# Altium schematic sheet EgSA-Cube3.SchDoc (part 1 of 3)
size 889 x 254 mm
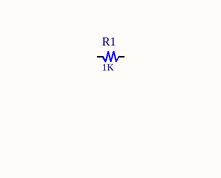
[diagram p0: EgSA-Cube3.SchDoc, top right]
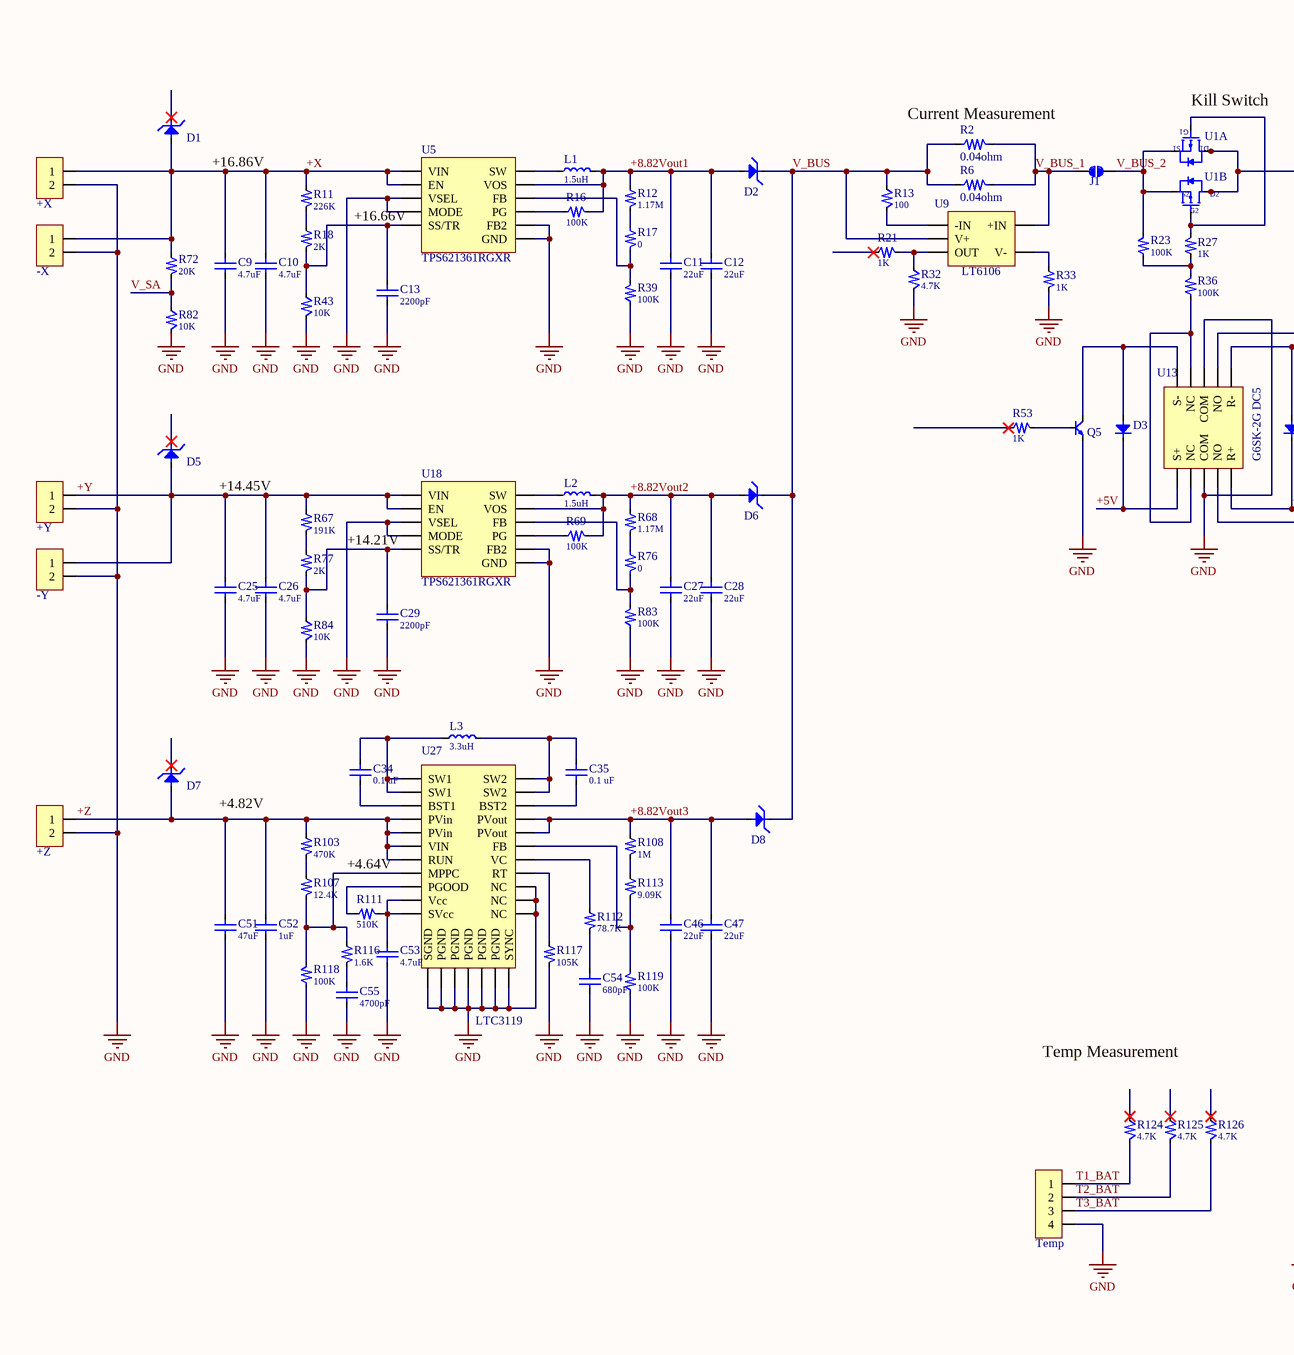
[diagram p1: EgSA-Cube3.SchDoc, bottom left]
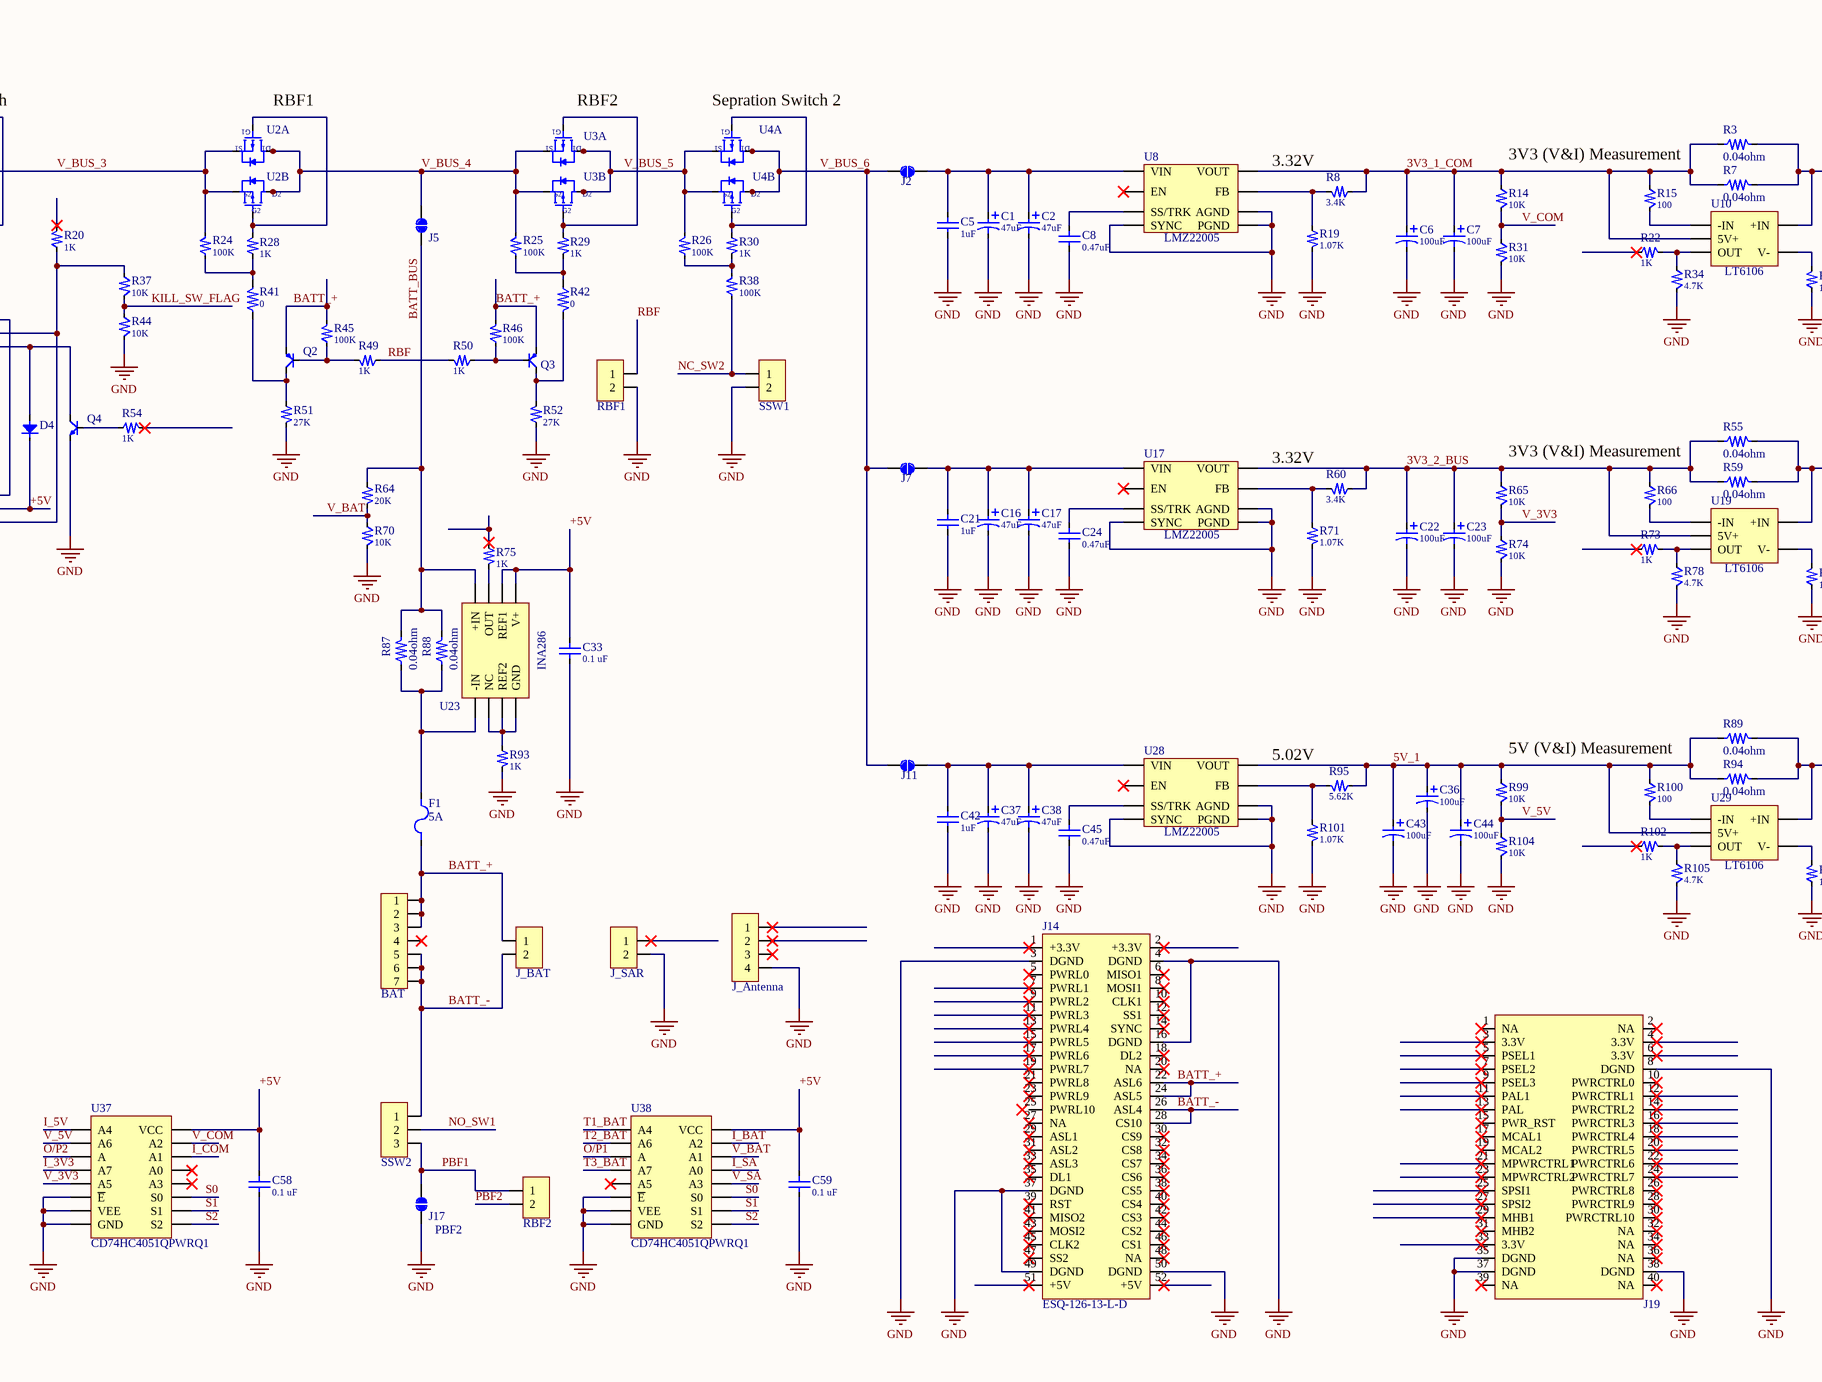
[diagram p2: EgSA-Cube3.SchDoc, bottom middle]
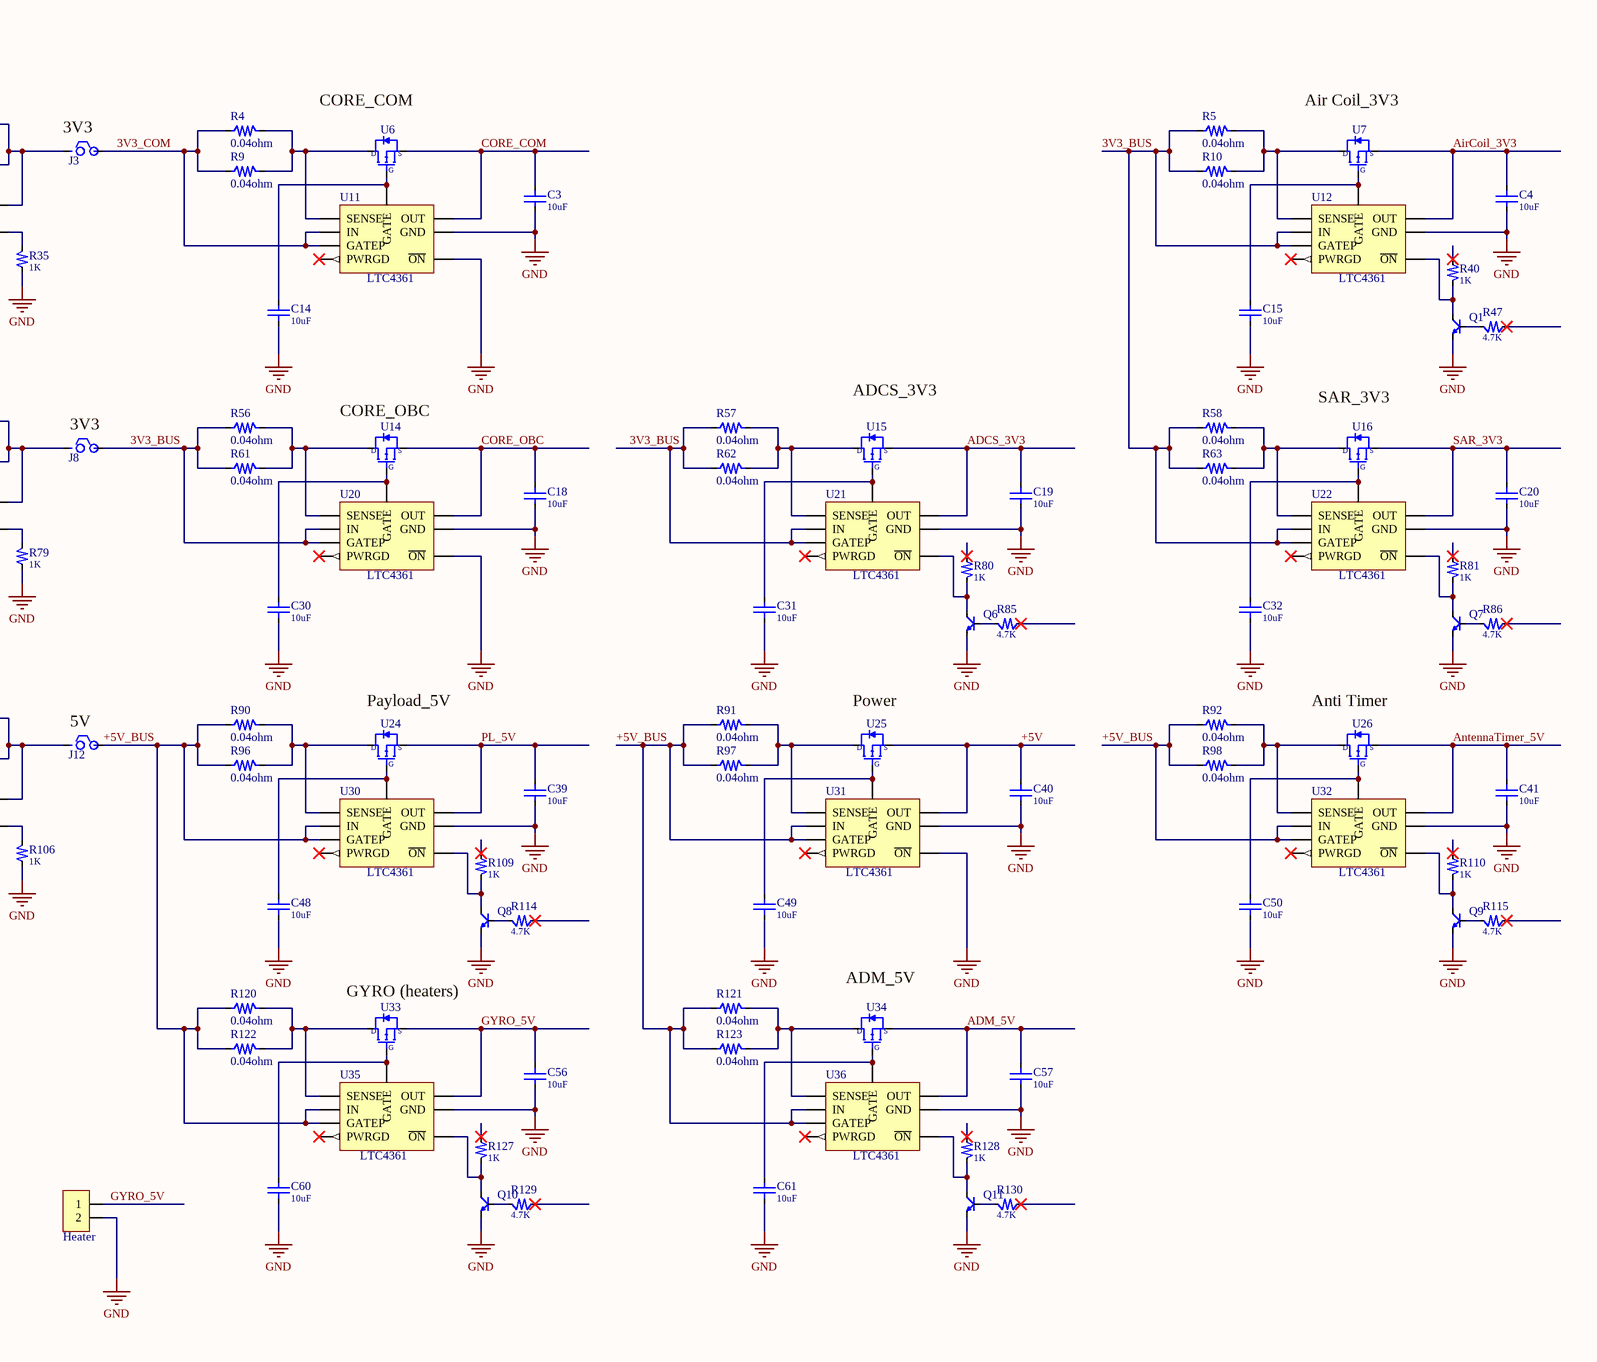
[diagram p3: EgSA-Cube3.SchDoc, bottom right]

## Parts
+X  53261-0271  [53261-0271]  (value not drawn)
+Y  53261-0271  [53261-0271]  (value not drawn)
+Z  53261-0271  [53261-0271]  (value not drawn)
-X  53261-0271  [53261-0271]  (value not drawn)
-Y  53261-0271  [53261-0271]  (value not drawn)
BAT  53261-0771  [53261-0771]  (value not drawn)
C1  value 47uF  [T591B476M010ATE070]  (hidden comment: T591B476M010ATE070)
C2  value 47uF  [T591B476M010ATE070]  (hidden comment: T591B476M010ATE070)
C3  value 10uF  [CL21B106KOQNNNE]  (hidden comment: CL21B106KOQNNNE)
C4  value 10uF  [CL21B106KOQNNNE]  (hidden comment: CL21B106KOQNNNE)
C5  value 1uF  [CL21B105KAFVPNE]  (hidden comment: CL21B105KAFVPNE)
C6  value 100uF  [T520B107M006ATE018]  (hidden comment: T520B107M006ATE018)
C7  value 100uF  [T520B107M006ATE018]  (hidden comment: T520B107M006ATE018)
C8  value 0.47uF  [0805YC474KAT2A]  (hidden comment: 0805YC474KAT2A)
C9  value 4.7uF  [CGA4J1X7R1V475K125AC]  (hidden comment: CGA4J1X7R1V475K125AC)
C10  value 4.7uF  [CGA4J1X7R1V475K125AC]  (hidden comment: CGA4J1X7R1V475K125AC)
C11  value 22uF  [C2012X5R1C226M125AC]  (hidden comment: C2012X5R1C226M125AC)
C12  value 22uF  [C2012X5R1C226M125AC]  (hidden comment: C2012X5R1C226M125AC)
C13  value 2200pF  [VJ0805Y222KXACW1BC]  (hidden comment: VJ0805Y222KXACW1BC)
C14  value 10uF  [CL21B106KOQNNNE]  (hidden comment: CL21B106KOQNNNE)
C15  value 10uF  [CL21B106KOQNNNE]  (hidden comment: CL21B106KOQNNNE)
C16  value 47uF  [T591B476M010ATE070]  (hidden comment: T591B476M010ATE070)
C17  value 47uF  [T591B476M010ATE070]  (hidden comment: T591B476M010ATE070)
C18  value 10uF  [CL21B106KOQNNNE]  (hidden comment: CL21B106KOQNNNE)
C19  value 10uF  [CL21B106KOQNNNE]  (hidden comment: CL21B106KOQNNNE)
C20  value 10uF  [CL21B106KOQNNNE]  (hidden comment: CL21B106KOQNNNE)
C21  value 1uF  [CL21B105KAFVPNE]  (hidden comment: CL21B105KAFVPNE)
C22  value 100uF  [T520B107M006ATE018]  (hidden comment: T520B107M006ATE018)
C23  value 100uF  [T520B107M006ATE018]  (hidden comment: T520B107M006ATE018)
C24  value 0.47uF  [0805YC474KAT2A]  (hidden comment: 0805YC474KAT2A)
C25  value 4.7uF  [CGA4J1X7R1V475K125AC]  (hidden comment: CGA4J1X7R1V475K125AC)
C26  value 4.7uF  [CGA4J1X7R1V475K125AC]  (hidden comment: CGA4J1X7R1V475K125AC)
C27  value 22uF  [C2012X5R1C226M125AC]  (hidden comment: C2012X5R1C226M125AC)
C28  value 22uF  [C2012X5R1C226M125AC]  (hidden comment: C2012X5R1C226M125AC)
C29  value 2200pF  [VJ0805Y222KXACW1BC]  (hidden comment: VJ0805Y222KXACW1BC)
C30  value 10uF  [CL21B106KOQNNNE]  (hidden comment: CL21B106KOQNNNE)
C31  value 10uF  [CL21B106KOQNNNE]  (hidden comment: CL21B106KOQNNNE)
C32  value 10uF  [CL21B106KOQNNNE]  (hidden comment: CL21B106KOQNNNE)
C33  value 0.1 uF  [C0805C104J4RACTU]  (hidden comment: C0805C104J4RACTU)
C34  value 0.1 uF  [C0805C104J4RACTU]  (hidden comment: C0805C104J4RACTU)
C35  value 0.1 uF  [C0805C104J4RACTU]  (hidden comment: C0805C104J4RACTU)
C36  value 100uF  [T520B107M006ATE018]  (hidden comment: T520B107M006ATE018)
C37  value 47uF  [T591B476M010ATE070]  (hidden comment: T591B476M010ATE070)
C38  value 47uF  [T591B476M010ATE070]  (hidden comment: T591B476M010ATE070)
C39  value 10uF  [CL21B106KOQNNNE]  (hidden comment: CL21B106KOQNNNE)
C40  value 10uF  [CL21B106KOQNNNE]  (hidden comment: CL21B106KOQNNNE)
C41  value 10uF  [CL21B106KOQNNNE]  (hidden comment: CL21B106KOQNNNE)
C42  value 1uF  [CL21B105KAFVPNE]  (hidden comment: CL21B105KAFVPNE)
C43  value 100uF  [T520B107M006ATE018]  (hidden comment: T520B107M006ATE018)
C44  value 100uF  [T520B107M006ATE018]  (hidden comment: T520B107M006ATE018)
C45  value 0.47uF  [0805YC474KAT2A]  (hidden comment: 0805YC474KAT2A)
C46  value 22uF  [C2012X5R1C226M125AC]  (hidden comment: C2012X5R1C226M125AC)
C47  value 22uF  [C2012X5R1C226M125AC]  (hidden comment: C2012X5R1C226M125AC)
C48  value 10uF  [CL21B106KOQNNNE]  (hidden comment: CL21B106KOQNNNE)
C49  value 10uF  [CL21B106KOQNNNE]  (hidden comment: CL21B106KOQNNNE)
C50  value 10uF  [CL21B106KOQNNNE]  (hidden comment: CL21B106KOQNNNE)
C51  value 47uF  [C2012X5R1A476M125AC]  (hidden comment: C2012X5R1A476M125AC)
C52  value 1uF  [CL21B105KAFVPNE]  (hidden comment: CL21B105KAFVPNE)
C53  value 4.7uF  [CGA4J1X7R1V475K125AC]  (hidden comment: CGA4J1X7R1V475K125AC)
C54  value 680pF  [VJ0805Y681JXXCW1BC]  (hidden comment: VJ0805Y681JXXCW1BC)
C55  value 4700pF  [C0805C472K4RAC7800]  (hidden comment: C0805C472K4RAC7800)
C56  value 10uF  [CL21B106KOQNNNE]  (hidden comment: CL21B106KOQNNNE)
C57  value 10uF  [CL21B106KOQNNNE]  (hidden comment: CL21B106KOQNNNE)
C58  value 0.1 uF  [C0805C104J4RACTU]  (hidden comment: C0805C104J4RACTU)
C59  value 0.1 uF  [C0805C104J4RACTU]  (hidden comment: C0805C104J4RACTU)
C60  value 10uF  [CL21B106KOQNNNE]  (hidden comment: CL21B106KOQNNNE)
C61  value 10uF  [CL21B106KOQNNNE]  (hidden comment: CL21B106KOQNNNE)
D1  SL22PL-TP  [SL22PL-TP]  (value not drawn)
D2  SL22PL-TP  [SL22PL-TP]  (value not drawn)
D3  MMSD459A  [MMSD459A]  (value not drawn)
D4  MMSD459A  [MMSD459A]  (value not drawn)
D5  SL22PL-TP  [SL22PL-TP]  (value not drawn)
D6  SL22PL-TP  [SL22PL-TP]  (value not drawn)
D7  SL22PL-TP  [SL22PL-TP]  (value not drawn)
D8  SL22PL-TP  [SL22PL-TP]  (value not drawn)
F1  Trip Current: 5A  [1206L500/12SLPR]  (hidden comment: 1206L500/12SLPR)
Heater  53261-0271  [53261-0271]  (value not drawn)
J1  JUMPER  [JUMPER]  (value not drawn)
J2  JUMPER  [JUMPER]  (value not drawn)
J3  ESW-102-13-L-S  [ESW-102-13-L-S]  (value not drawn)
J5  JUMPER  [JUMPER]  (value not drawn)
J7  JUMPER  [JUMPER]  (value not drawn)
J8  ESW-102-13-L-S  [ESW-102-13-L-S]  (value not drawn)
J11  JUMPER  [JUMPER]  (value not drawn)
J12  ESW-102-13-L-S  [ESW-102-13-L-S]  (value not drawn)
J14  ESQ-126-13-L-D  [ESQ-126-13-L-D]
J17  JUMPER  [JUMPER]  (value not drawn)
J19  ESQ-120-13-L-D  [ESQ-120-13-L-D]  (value not drawn)
J_Antenna  53261-0471  [53261-0471]  (value not drawn)
J_BAT  53261-0271  [53261-0271]  (value not drawn)
J_SAR  53261-0271  [53261-0271]  (value not drawn)
L1  value 1.5uH  [XEL4020-152MEB]  (hidden comment: XEL4020-152MEB)
L2  value 1.5uH  [XEL4020-152MEB]  (hidden comment: XEL4020-152MEB)
L3  value 3.3uH  [XEL4030-332MEC]  (hidden comment: XEL4030-332MEC)
Q1  SMMBT3904LT3G  [SMMBT3904LT3G]  (value not drawn)
Q2  CMPT404A TR  [CMPT404A TR]  (value not drawn)
Q3  CMPT404A TR  [CMPT404A TR]  (value not drawn)
Q4  SMMBT3904LT3G  [SMMBT3904LT3G]  (value not drawn)
Q5  SMMBT3904LT3G  [SMMBT3904LT3G]  (value not drawn)
Q6  SMMBT3904LT3G  [SMMBT3904LT3G]  (value not drawn)
Q7  SMMBT3904LT3G  [SMMBT3904LT3G]  (value not drawn)
Q8  SMMBT3904LT3G  [SMMBT3904LT3G]  (value not drawn)
Q9  SMMBT3904LT3G  [SMMBT3904LT3G]  (value not drawn)
Q10  SMMBT3904LT3G  [SMMBT3904LT3G]  (value not drawn)
Q11  SMMBT3904LT3G  [SMMBT3904LT3G]  (value not drawn)
R1  value 1K  [ERJ-P6WJ102V]  (hidden comment: ERJ-P6WJ102V)
R2  value 0.04ohm  [RL3720WT-R040-G]  (hidden comment: RL3720WT-R040-G)
R3  value 0.04ohm  [RL3720WT-R040-G]  (hidden comment: RL3720WT-R040-G)
R4  value 0.04ohm  [RL3720WT-R040-G]  (hidden comment: RL3720WT-R040-G)
R5  value 0.04ohm  [RL3720WT-R040-G]  (hidden comment: RL3720WT-R040-G)
R6  value 0.04ohm  [RL3720WT-R040-G]  (hidden comment: RL3720WT-R040-G)
R7  value 0.04ohm  [RL3720WT-R040-G]  (hidden comment: RL3720WT-R040-G)
R8  value 3.4K  [ERJ-P06F3401V]  (hidden comment: ERJ-P06F3401V)
R9  value 0.04ohm  [RL3720WT-R040-G]  (hidden comment: RL3720WT-R040-G)
R10  value 0.04ohm  [RL3720WT-R040-G]  (hidden comment: RL3720WT-R040-G)
R11  value 226K  [RK73H2ATTD2263F]  (hidden comment: RK73H2ATTD2263F)
R12  value 1.17M  [RT0805BRD071M17L]  (hidden comment: RT0805BRD071M17L)
R13  value 100  [CRCW0805100RFKEAHP]  (hidden comment: CRCW0805100RFKEAHP)
R14  value 10K  [ERJ-P06F1002V]  (hidden comment: ERJ-P06F1002V)
R15  value 100  [CRCW0805100RFKEAHP]  (hidden comment: CRCW0805100RFKEAHP)
R16  value 100K  [CRCW0805100KFKEAHP]  (hidden comment: CRCW0805100KFKEAHP)
R17  value 0  [CRCW08050000Z0EAHP]  (hidden comment: CRCW08050000Z0EAHP)
R18  value 2K  [CRCW08052K00FKEAHP]  (hidden comment: CRCW08052K00FKEAHP)
R19  value 1.07K  [ERJ-P06F1071V]  (hidden comment: ERJ-P06F1071V)
R20  value 1K  [CRCW08051K00FKEAHP]  (hidden comment: CRCW08051K00FKEAHP)
R21  value 1K  [CRCW08051K00FKEAHP]  (hidden comment: CRCW08051K00FKEAHP)
R22  value 1K  [CRCW08051K00FKEAHP]  (hidden comment: CRCW08051K00FKEAHP)
R23  value 100K  [CRCW0805100KFKEAHP]  (hidden comment: CRCW0805100KFKEAHP)
R24  value 100K  [CRCW0805100KFKEAHP]  (hidden comment: CRCW0805100KFKEAHP)
R25  value 100K  [CRCW0805100KFKEAHP]  (hidden comment: CRCW0805100KFKEAHP)
R26  value 100K  [CRCW0805100KFKEAHP]  (hidden comment: CRCW0805100KFKEAHP)
R27  value 1K  [CRCW08051K00FKEAHP]  (hidden comment: CRCW08051K00FKEAHP)
R28  value 1K  [CRCW08051K00FKEAHP]  (hidden comment: CRCW08051K00FKEAHP)
R29  value 1K  [CRCW08051K00FKEAHP]  (hidden comment: CRCW08051K00FKEAHP)
R30  value 1K  [CRCW08051K00FKEAHP]  (hidden comment: CRCW08051K00FKEAHP)
R31  value 10K  [ERJ-P06F1002V]  (hidden comment: ERJ-P06F1002V)
R32  value 4.7K  [ERJ-P06F4701V]  (hidden comment: ERJ-P06F4701V)
R33  value 1K  [CRCW08051K00FKEAHP]  (hidden comment: CRCW08051K00FKEAHP)
R34  value 4.7K  [ERJ-P06F4701V]  (hidden comment: ERJ-P06F4701V)
R35  value 1K  [CRCW08051K00FKEAHP]  (hidden comment: CRCW08051K00FKEAHP)
R36  value 100K  [CRCW0805100KFKEAHP]  (hidden comment: CRCW0805100KFKEAHP)
R37  value 10K  [ERJ-P06F1002V]  (hidden comment: ERJ-P06F1002V)
R38  value 100K  [CRCW0805100KFKEAHP]  (hidden comment: CRCW0805100KFKEAHP)
R39  value 100K  [CRCW0805100KFKEAHP]  (hidden comment: CRCW0805100KFKEAHP)
R40  value 1K  [CRCW08051K00FKEAHP]  (hidden comment: CRCW08051K00FKEAHP)
R41  value 0  [HCJ0805ZT0R00]  (hidden comment: HCJ0805ZT0R00)
R42  value 0  [HCJ0805ZT0R00]  (hidden comment: HCJ0805ZT0R00)
R43  value 10K  [ERJ-P06F1002V]  (hidden comment: ERJ-P06F1002V)
R44  value 10K  [ERJ-P06F1002V]  (hidden comment: ERJ-P06F1002V)
R45  value 100K  [CRCW0805100KFKEAHP]  (hidden comment: CRCW0805100KFKEAHP)
R46  value 100K  [CRCW0805100KFKEAHP]  (hidden comment: CRCW0805100KFKEAHP)
R47  value 4.7K  [ERJ-P06F4701V]  (hidden comment: ERJ-P06F4701V)
R49  value 1K  [CRCW08051K00FKEAHP]  (hidden comment: CRCW08051K00FKEAHP)
R50  value 1K  [CRCW08051K00FKEAHP]  (hidden comment: CRCW08051K00FKEAHP)
R51  value 27K  [ERJ-P6WF2702V]  (hidden comment: ERJ-P6WF2702V)
R52  value 27K  [ERJ-P6WF2702V]  (hidden comment: ERJ-P6WF2702V)
R53  value 1K  [CRCW08051K00FKEAHP]  (hidden comment: CRCW08051K00FKEAHP)
R54  value 1K  [CRCW08051K00FKEAHP]  (hidden comment: CRCW08051K00FKEAHP)
R55  value 0.04ohm  [RL3720WT-R040-G]  (hidden comment: RL3720WT-R040-G)
R56  value 0.04ohm  [RL3720WT-R040-G]  (hidden comment: RL3720WT-R040-G)
R57  value 0.04ohm  [RL3720WT-R040-G]  (hidden comment: RL3720WT-R040-G)
R58  value 0.04ohm  [RL3720WT-R040-G]  (hidden comment: RL3720WT-R040-G)
R59  value 0.04ohm  [RL3720WT-R040-G]  (hidden comment: RL3720WT-R040-G)
R60  value 3.4K  [ERJ-P06F3401V]  (hidden comment: ERJ-P06F3401V)
R61  value 0.04ohm  [RL3720WT-R040-G]  (hidden comment: RL3720WT-R040-G)
R62  value 0.04ohm  [RL3720WT-R040-G]  (hidden comment: RL3720WT-R040-G)
R63  value 0.04ohm  [RL3720WT-R040-G]  (hidden comment: RL3720WT-R040-G)
R64  value 20K  [CRCW080520K0FKEAHP]  (hidden comment: CRCW080520K0FKEAHP)
R65  value 10K  [ERJ-P06F1002V]  (hidden comment: ERJ-P06F1002V)
R66  value 100  [CRCW0805100RFKEAHP]  (hidden comment: CRCW0805100RFKEAHP)
R67  value 191K  [ERJ-P06F1913V]  (hidden comment: ERJ-P06F1913V)
R68  value 1.17M  [RT0805BRD071M17L]  (hidden comment: RT0805BRD071M17L)
R69  value 100K  [CRCW0805100KFKEAHP]  (hidden comment: CRCW0805100KFKEAHP)
R70  value 10K  [ERJ-P06F1002V]  (hidden comment: ERJ-P06F1002V)
R71  value 1.07K  [ERJ-P06F1071V]  (hidden comment: ERJ-P06F1071V)
R72  value 20K  [CRCW080520K0FKEAHP]  (hidden comment: CRCW080520K0FKEAHP)
R73  value 1K  [CRCW08051K00FKEAHP]  (hidden comment: CRCW08051K00FKEAHP)
R74  value 10K  [ERJ-P06F1002V]  (hidden comment: ERJ-P06F1002V)
R75  value 1K  [CRCW08051K00FKEAHP]  (hidden comment: CRCW08051K00FKEAHP)
R76  value 0  [CRCW08050000Z0EAHP]  (hidden comment: CRCW08050000Z0EAHP)
R77  value 2K  [CRCW08052K00FKEAHP]  (hidden comment: CRCW08052K00FKEAHP)
R78  value 4.7K  [ERJ-P06F4701V]  (hidden comment: ERJ-P06F4701V)
R79  value 1K  [CRCW08051K00FKEAHP]  (hidden comment: CRCW08051K00FKEAHP)
R80  value 1K  [CRCW08051K00FKEAHP]  (hidden comment: CRCW08051K00FKEAHP)
R81  value 1K  [CRCW08051K00FKEAHP]  (hidden comment: CRCW08051K00FKEAHP)
R82  value 10K  [ERJ-P06F1002V]  (hidden comment: ERJ-P06F1002V)
R83  value 100K  [CRCW0805100KFKEAHP]  (hidden comment: CRCW0805100KFKEAHP)
R84  value 10K  [ERJ-P06F1002V]  (hidden comment: ERJ-P06F1002V)
R85  value 4.7K  [ERJ-P06F4701V]  (hidden comment: ERJ-P06F4701V)
R86  value 4.7K  [ERJ-P06F4701V]  (hidden comment: ERJ-P06F4701V)
R87  value 0.04ohm  [RL3720WT-R040-G]  (hidden comment: RL3720WT-R040-G)
R88  value 0.04ohm  [RL3720WT-R040-G]  (hidden comment: RL3720WT-R040-G)
R89  value 0.04ohm  [RL3720WT-R040-G]  (hidden comment: RL3720WT-R040-G)
R90  value 0.04ohm  [RL3720WT-R040-G]  (hidden comment: RL3720WT-R040-G)
R91  value 0.04ohm  [RL3720WT-R040-G]  (hidden comment: RL3720WT-R040-G)
R92  value 0.04ohm  [RL3720WT-R040-G]  (hidden comment: RL3720WT-R040-G)
R93  value 1K  [CRCW08051K00FKEAHP]  (hidden comment: CRCW08051K00FKEAHP)
R94  value 0.04ohm  [RL3720WT-R040-G]  (hidden comment: RL3720WT-R040-G)
R95  value 5.62K  [CRCW08055K62FKEAHP]  (hidden comment: CRCW08055K62FKEAHP)
R96  value 0.04ohm  [RL3720WT-R040-G]  (hidden comment: RL3720WT-R040-G)
R97  value 0.04ohm  [RL3720WT-R040-G]  (hidden comment: RL3720WT-R040-G)
R98  value 0.04ohm  [RL3720WT-R040-G]  (hidden comment: RL3720WT-R040-G)
R99  value 10K  [ERJ-P06F1002V]  (hidden comment: ERJ-P06F1002V)
R100  value 100  [CRCW0805100RFKEAHP]  (hidden comment: CRCW0805100RFKEAHP)
R101  value 1.07K  [ERJ-P06F1071V]  (hidden comment: ERJ-P06F1071V)
R102  value 1K  [CRCW08051K00FKEAHP]  (hidden comment: CRCW08051K00FKEAHP)
R103  value 470K  [CRCW0805470KFKEAHP]  (hidden comment: CRCW0805470KFKEAHP)
R104  value 10K  [ERJ-P06F1002V]  (hidden comment: ERJ-P06F1002V)
R105  value 4.7K  [ERJ-P06F4701V]  (hidden comment: ERJ-P06F4701V)
R106  value 1K  [CRCW08051K00FKEAHP]  (hidden comment: CRCW08051K00FKEAHP)
R107  value 12.4K  [CRCW080512K4FKEAHP]  (hidden comment: CRCW080512K4FKEAHP)
R108  value 1M  [CRCW08051M00FKEAHP]  (hidden comment: CRCW08051M00FKEAHP)
R109  value 1K  [CRCW08051K00FKEAHP]  (hidden comment: CRCW08051K00FKEAHP)
R110  value 1K  [CRCW08051K00FKEAHP]  (hidden comment: CRCW08051K00FKEAHP)
R111  value 510K  [CRCW0805510KFKEAHP]  (hidden comment: CRCW0805510KFKEAHP)
R112  value 78.7K  [ERJ-P06F7872V]  (hidden comment: ERJ-P06F7872V)
R113  value 9.09K  [CRCW08059K09FKEAHP]  (hidden comment: CRCW08059K09FKEAHP)
R114  value 4.7K  [ERJ-P06F4701V]  (hidden comment: ERJ-P06F4701V)
R115  value 4.7K  [ERJ-P06F4701V]  (hidden comment: ERJ-P06F4701V)
R116  value 1.6K  [ERJ-P06F1601V]  (hidden comment: ERJ-P06F1601V)
R117  value 105K  [ERJ-P06F1053V]  (hidden comment: ERJ-P06F1053V)
R118  value 100K  [CRCW0805100KFKEAHP]  (hidden comment: CRCW0805100KFKEAHP)
R119  value 100K  [CRCW0805100KFKEAHP]  (hidden comment: CRCW0805100KFKEAHP)
R120  value 0.04ohm  [RL3720WT-R040-G]  (hidden comment: RL3720WT-R040-G)
R121  value 0.04ohm  [RL3720WT-R040-G]  (hidden comment: RL3720WT-R040-G)
R122  value 0.04ohm  [RL3720WT-R040-G]  (hidden comment: RL3720WT-R040-G)
R123  value 0.04ohm  [RL3720WT-R040-G]  (hidden comment: RL3720WT-R040-G)
R124  value 4.7K  [ERJ-P06F4701V]  (hidden comment: ERJ-P06F4701V)
R125  value 4.7K  [ERJ-P06F4701V]  (hidden comment: ERJ-P06F4701V)
R126  value 4.7K  [ERJ-P06F4701V]  (hidden comment: ERJ-P06F4701V)
R127  value 1K  [CRCW08051K00FKEAHP]  (hidden comment: CRCW08051K00FKEAHP)
R128  value 1K  [CRCW08051K00FKEAHP]  (hidden comment: CRCW08051K00FKEAHP)
R129  value 4.7K  [ERJ-P06F4701V]  (hidden comment: ERJ-P06F4701V)
R130  value 4.7K  [ERJ-P06F4701V]  (hidden comment: ERJ-P06F4701V)
RBF1  53261-0271  [53261-0271]  (value not drawn)
RBF2  53261-0271  [53261-0271]  (value not drawn)
SSW1  53261-0271  [53261-0271]  (value not drawn)
SSW2  53261-0371  [53261-0371]  (value not drawn)
Temp  53261-0471  [53261-0471]  (value not drawn)
U1  IRF7329TRPBF  [IRF7329TRPBF]  (value not drawn)  (parts A,B of 2)
U2  IRF7329TRPBF  [IRF7329TRPBF]  (value not drawn)  (parts A,B of 2)
U3  IRF7329TRPBF  [IRF7329TRPBF]  (value not drawn)  (parts A,B of 2)
U4  IRF7329TRPBF  [IRF7329TRPBF]  (value not drawn)  (parts A,B of 2)
U5  TPS621361RGXR  [TPS621361RGXR]
U6  IRFML8244TRPBF  [IRFML8244TRPBF]  (value not drawn)
U7  IRFML8244TRPBF  [IRFML8244TRPBF]  (value not drawn)
U8  LMZ22005  [LMZ22005TZX/NOPB]
U9  LT6106  [LT6106HS5#TRPBF]
U10  LT6106  [LT6106HS5#TRPBF]
U11  LTC4361  [LTC4361HTS8-2]
U12  LTC4361  [LTC4361HTS8-2]
U13  G6SK-2G DC5  [G6SK-2G DC5]
U14  IRFML8244TRPBF  [IRFML8244TRPBF]  (value not drawn)
U15  IRFML8244TRPBF  [IRFML8244TRPBF]  (value not drawn)
U16  IRFML8244TRPBF  [IRFML8244TRPBF]  (value not drawn)
U17  LMZ22005  [LMZ22005TZX/NOPB]
U18  TPS621361RGXR  [TPS621361RGXR]
U19  LT6106  [LT6106HS5#TRPBF]
U20  LTC4361  [LTC4361HTS8-2]
U21  LTC4361  [LTC4361HTS8-2]
U22  LTC4361  [LTC4361HTS8-2]
U23  INA286  [INA286AQDRQ1]
U24  IRFML8244TRPBF  [IRFML8244TRPBF]  (value not drawn)
U25  IRFML8244TRPBF  [IRFML8244TRPBF]  (value not drawn)
U26  IRFML8244TRPBF  [IRFML8244TRPBF]  (value not drawn)
U27  LTC3119  [LTC3119EUFD#PBF]
U28  LMZ22005  [LMZ22005TZX/NOPB]
U29  LT6106  [LT6106HS5#TRPBF]
U30  LTC4361  [LTC4361HTS8-2]
U31  LTC4361  [LTC4361HTS8-2]
U32  LTC4361  [LTC4361HTS8-2]
U33  IRFML8244TRPBF  [IRFML8244TRPBF]  (value not drawn)
U34  IRFML8244TRPBF  [IRFML8244TRPBF]  (value not drawn)
U35  LTC4361  [LTC4361HTS8-2]
U36  LTC4361  [LTC4361HTS8-2]
U37  CD74HC4051QPWRQ1  [CD74HC4051QPWRQ1]
U38  CD74HC4051QPWRQ1  [CD74HC4051QPWRQ1]

## Nets
GND: +X.2 +Y.2 +Z.2 -X.2 -Y.2 C1.2 C2.2 C3.1 C4.1 C5.1 C6.2 C7.2 C8.1 C9.1 C10.1 C11.1 C12.1 C13.1 C14.2 C15.2 C16.2 C17.2 C18.1 C19.1 C20.1 C21.1 C22.2 C23.2 C24.1 C25.1 C26.1 C27.1 C28.1 C29.1 C30.2 C31.2 C32.2 C33.1 C36.2 C37.2 C38.2 C39.1 C40.1 C41.1 C42.1 C43.2 C44.2 C45.1 C46.1 C47.1 C48.2 C49.2 C50.2 C51.1 C52.1 C53.2 C54.1 C55.1 C56.1 C57.1 C58.1 C59.1 C60.2 C61.2 Heater.2 J14.3(DGND) J14.4(DGND) J14.16(DGND) J14.37(DGND) J14.49(DGND) J14.50(DGND) J17.1 J19.8(DGND) J19.35(DGND) J19.37(DGND) J19.38(DGND) J_Antenna.4 J_SAR.2 Q1.2(E) Q4.2(E) Q5.2(E) Q6.2(E) Q7.2(E) Q8.2(E) Q9.2(E) Q10.2(E) Q11.2(E) R19.1 R31.1 R32.1 R33.1 R34.1 R35.2 R39.2 R43.1 R44.1 R51.1 R52.1 R70.1 R71.1 R74.1 R78.1 R79.2 R82.1 R83.2 R84.1 R93.1 R101.1 R104.1 R105.1 R106.2 R117.1 R118.2 R119.2 RBF1.2 SSW1.2 Temp.4 U5.3(GND) U5.4(FB2) U5.10(MODE) U5.11(VSEL) U8.2(SYNC) U8.4(AGND) U8.8(PGND) U11.1(~{ON}) U11.4(GND) U12.4(GND) U13.3(COM) U13.8(COM) U17.2(SYNC) U17.4(AGND) U17.8(PGND) U18.3(GND) U18.4(FB2) U18.10(MODE) U18.11(VSEL) U20.1(~{ON}) U20.4(GND) U21.4(GND) U22.4(GND) U27.1(PGND) U27.6(PGND) U27.11(SGND) U27.17(PGND) U27.22(PGND) U27.24(NC) U27.25(SYNC) U27.26(NC) U27.27(NC) U27.29(PGND) U28.2(SYNC) U28.4(AGND) U28.8(PGND) U30.4(GND) U31.1(~{ON}) U31.4(GND) U32.4(GND) U35.4(GND) U36.4(GND) U37.6(~{E}) U37.7(VEE) U37.8(GND) U38.6(~{E}) U38.7(VEE) U38.8(GND)
3V3_1_COM: C6.1 C7.1 R3.1 R7.1 R8.2 R14.2 R15.2 U8.7(VOUT) U10.5(5V+)
3V3_2_BUS: C22.1 C23.1 R55.1 R59.1 R60.2 R65.2 R66.2 U17.7(VOUT) U19.5(5V+)
3V3_BUS: J8.2 R5.1 R10.1 R56.1 R57.1 R58.1 R61.1 R62.1 R63.1 U12.3(GATEP) U12.5(IN) U20.3(GATEP) U20.5(IN) U21.3(GATEP) U21.5(IN) U22.3(GATEP) U22.5(IN)
3V3_COM: J3.2 R4.1 R9.1 U11.3(GATEP) U11.5(IN)
5V_1: C36.1 C43.1 C44.1 R89.1 R94.1 R95.2 R99.2 R100.2 U28.7(VOUT) U29.5(5V+)
+5V: C33.2 C40.2 C58.2 C59.2 D3.1 D4.1 U13.1(S+) U13.5(R+) U23.6(V+) U23.7(REF1) U25.2(S) U31.2(OUT) U37.16(VCC) U38.16(VCC)
+5V_BUS: J12.2 R90.1 R91.1 R92.1 R96.1 R97.1 R98.1 R120.1 R121.1 R122.1 R123.1 U30.3(GATEP) U30.5(IN) U31.3(GATEP) U31.5(IN) U32.3(GATEP) U32.5(IN) U35.3(GATEP) U35.5(IN) U36.3(GATEP) U36.5(IN)
+8.82Vout1: C11.2 C12.2 D2.2 L1.2 R12.2 R16.1 U5.6(VOS)
+8.82Vout2: C27.2 C28.2 D6.2 L2.2 R68.2 R69.1 U18.6(VOS)
+8.82Vout3: C46.2 C47.2 D8.2 R108.2 U27.3(PVout) U27.4(PVout)
+X: +X.1 -X.1 C9.2 C10.2 D1.2 R11.2 R72.2 U5.1(VIN) U5.8(EN)
+Y: +Y.1 -Y.1 C25.2 C26.2 D5.2 R67.2 U18.1(VIN) U18.8(EN)
+Z: +Z.1 C51.2 C52.2 D7.2 R103.2 U27.15(RUN) U27.16(VIN) U27.19(PVin) U27.20(PVin)
ADCS_3V3: C19.2 U15.2(S) U21.2(OUT)
ADM_5V: C57.2 U34.2(S) U36.2(OUT)
AirCoil_3V3: C4.2 U7.2(S) U12.2(OUT)
AntennaTimer_5V: C41.2 U26.2(S) U32.2(OUT)
BATT_+: BAT.1 BAT.2 BAT.3 F1.1 J14.22(ASL6) J14.24(ASL5) J_BAT.1 Q2.3(C) Q3.3(C) R45.1 R46.1
BATT_-: BAT.5 BAT.6 BAT.7 J14.26(ASL4) J14.28(CS10) J_BAT.2 SSW2.1
BATT_BUS: J5.1 R64.2 R87.2 R88.2 U23.8(+IN)
CORE_COM: C3.2 U6.2(S) U11.2(OUT)
CORE_OBC: C18.2 U14.2(S) U20.2(OUT)
GYRO_5V: C56.2 Heater.1 U33.2(S) U35.2(OUT)
I_3V3: U37.4(A7)
I_5V: U37.1(A4)
I_BAT: U38.15(A2)
I_COM: U37.14(A1)
I_SA: U38.13(A0)
KILL_SW_FLAG: R37.1 R44.2
NC_SW2: R38.2 SSW1.1
NO_SW1: SSW2.2
O/P1: U38.3(A)
O/P2: U37.3(A)
PBF1: J17.2 RBF2.1 SSW2.3
PBF2: RBF2.2
PL_5V: C39.2 U24.2(S) U30.2(OUT)
RBF: R49.2 R50.1 RBF1.1
S0: U37.11(S0) U38.11(S0)
S1: U37.10(S1) U38.10(S1)
S2: U37.9(S2) U38.9(S2)
SAR_3V3: C20.2 U16.2(S) U22.2(OUT)
T1_BAT: R124.1 Temp.1 U38.1(A4)
T2_BAT: R125.1 Temp.2 U38.2(A6)
T3_BAT: R126.1 Temp.3 U38.4(A7)
V_3V3: R65.1 R74.2 U37.5(A5)
V_5V: R99.1 R104.2 U37.2(A6)
V_BAT: R64.1 R70.2 U38.14(A1)
V_BUS: D2.1 D6.1 D8.1 R2.1 R6.1 R13.2 U9.5(V+)
V_BUS_1: J1.1 R2.2 R6.2 U9.4(+IN)
V_BUS_2: J1.2 R23.1 U1.1(S1) U1.3(S2)
V_BUS_3: R24.1 U1.5(D2) U1.6(D2) U1.7(D1) U1.8(D1) U2.1(S1) U2.3(S2)
V_BUS_4: J5.2 R25.1 U2.5(D2) U2.6(D2) U2.7(D1) U2.8(D1) U3.1(S1) U3.3(S2)
V_BUS_5: R26.1 U3.5(D2) U3.6(D2) U3.7(D1) U3.8(D1) U4.1(S1) U4.3(S2)
V_BUS_6: J2.1 J7.1 J11.1 U4.5(D2) U4.6(D2) U4.7(D1) U4.8(D1)
V_COM: R14.1 R31.2 U37.15(A2)
V_SA: R72.1 R82.2 U38.12(A3)
NetC1_1: C1.1 C2.1 C5.2 J2.2 U8.1(VIN)
NetC8_2: C8.2 U8.6(SS/TRK)
NetC13_2: C13.2 R18.1 R43.2 U5.9(SS/TR)
NetC14_1: C14.1 U6.1(G) U11.7(GATE)
NetC15_1: C15.1 U7.1(G) U12.7(GATE)
NetC16_1: C16.1 C17.1 C21.2 J7.2 U17.1(VIN)
NetC24_2: C24.2 U17.6(SS/TRK)
NetC29_2: C29.2 R77.1 R84.2 U18.9(SS/TR)
NetC30_1: C30.1 U14.1(G) U20.7(GATE)
NetC31_1: C31.1 U15.1(G) U21.7(GATE)
NetC32_1: C32.1 U16.1(G) U22.7(GATE)
NetC34_1: C34.1 U27.23(BST1)
NetC34_2: C34.2 L3.1 U27.18(SW1) U27.21(SW1)
NetC35_1: C35.1 U27.28(BST2)
NetC35_2: C35.2 L3.2 U27.2(SW2) U27.5(SW2)
NetC37_1: C37.1 C38.1 C42.2 J11.2 U28.1(VIN)
NetC45_2: C45.2 U28.6(SS/TRK)
NetC48_1: C48.1 U24.1(G) U30.7(GATE)
NetC49_1: C49.1 U25.1(G) U31.7(GATE)
NetC50_1: C50.1 U26.1(G) U32.7(GATE)
NetC53_1: C53.1 R111.1 U27.8(SVcc) U27.13(Vcc)
NetC54_2: C54.2 R112.1
NetC55_2: C55.2 R116.1
NetC60_1: C60.1 U33.1(G) U35.7(GATE)
NetC61_1: C61.1 U34.1(G) U36.7(GATE)
NetD3_2: D3.2 Q5.3(C) U13.10(S-)
NetD4_2: D4.2 Q4.3(C) U13.6(R-)
NetF1_2: F1.2 R87.1 R88.1 U23.1(-IN)
NetJ3_1: J3.1 R3.2 R7.2 U10.4(+IN)
NetJ8_1: J8.1 R55.2 R59.2 U19.4(+IN)
NetJ12_1: J12.1 R89.2 R94.2 U29.4(+IN)
NetL1_1: L1.1 U5.2(SW)
NetL2_1: L2.1 U18.2(SW)
NetQ1_1: Q1.1(B) R47.1
NetQ1_3: Q1.3(C) R40.1 U12.1(~{ON})
NetQ2_1: Q2.1(B) R45.2 R49.1
NetQ2_2: Q2.2(E) R41.1 R51.2
NetQ3_1: Q3.1(B) R46.2 R50.2
NetQ3_2: Q3.2(E) R42.1 R52.2
NetQ4_1: Q4.1(B) R54.2
NetQ5_1: Q5.1(B) R53.1
NetQ6_1: Q6.1(B) R85.1
NetQ6_3: Q6.3(C) R80.1 U21.1(~{ON})
NetQ7_1: Q7.1(B) R86.1
NetQ7_3: Q7.3(C) R81.1 U22.1(~{ON})
NetQ8_1: Q8.1(B) R114.1
NetQ8_3: Q8.3(C) R109.1 U30.1(~{ON})
NetQ9_1: Q9.1(B) R115.1
NetQ9_3: Q9.3(C) R110.1 U32.1(~{ON})
NetQ10_1: Q10.1(B) R129.1
NetQ10_3: Q10.3(C) R127.1 U35.1(~{ON})
NetQ11_1: Q11.1(B) R130.1
NetQ11_3: Q11.3(C) R128.1 U36.1(~{ON})
NetR4_2: R4.2 R9.2 U6.3(D) U11.6(SENSE)
NetR5_2: R5.2 R10.2 U7.3(D) U12.6(SENSE)
NetR8_1: R8.1 R19.2 U8.5(FB)
NetR11_1: R11.1 R18.2
NetR12_1: R12.1 R17.2
NetR13_1: R13.1 U9.3(-IN)
NetR15_1: R15.1 U10.3(-IN)
NetR16_2: R16.2 U5.7(PG)
NetR17_1: R17.1 R39.1 U5.5(FB)
NetR20_2: R20.2 R37.2 U13.4(NO) U13.7(NO)
NetR21_1: R21.1 R32.2 U9.1(OUT)
NetR22_1: R22.1 R34.2 U10.1(OUT)
NetR23_2: R23.2 R27.2 R36.1
NetR24_2: R24.2 R28.2 R41.2
NetR25_2: R25.2 R29.1 R42.2
NetR26_2: R26.2 R30.1 R38.1
NetR27_1: R27.1 U1.2(G1) U1.4(G2)
NetR28_1: R28.1 U2.2(G1) U2.4(G2)
NetR29_2: R29.2 U3.2(G1) U3.4(G2)
NetR30_2: R30.2 U4.2(G1) U4.4(G2)
NetR33_2: R33.2 U9.2(V-)
NetR35_1: R35.1 U10.2(V-)
NetR36_2: R36.2 U13.2(NC) U13.9(NC)
NetR56_2: R56.2 R61.2 U14.3(D) U20.6(SENSE)
NetR57_2: R57.2 R62.2 U15.3(D) U21.6(SENSE)
NetR58_2: R58.2 R63.2 U16.3(D) U22.6(SENSE)
NetR60_1: R60.1 R71.2 U17.5(FB)
NetR66_1: R66.1 U19.3(-IN)
NetR67_1: R67.1 R77.2
NetR68_1: R68.1 R76.2
NetR69_2: R69.2 U18.7(PG)
NetR73_1: R73.1 R78.2 U19.1(OUT)
NetR75_1: R75.1 U23.5(OUT)
NetR76_1: R76.1 R83.1 U18.5(FB)
NetR79_1: R79.1 U19.2(V-)
NetR90_2: R90.2 R96.2 U24.3(D) U30.6(SENSE)
NetR91_2: R91.2 R97.2 U25.3(D) U31.6(SENSE)
NetR92_2: R92.2 R98.2 U26.3(D) U32.6(SENSE)
NetR93_2: R93.2 U23.2(GND) U23.3(REF2) U23.4(NC)
NetR95_1: R95.1 R101.2 U28.5(FB)
NetR100_1: R100.1 U29.3(-IN)
NetR102_1: R102.1 R105.2 U29.1(OUT)
NetR103_1: R103.1 R107.2
NetR106_1: R106.1 U29.2(V-)
NetR107_1: R107.1 R116.2 R118.1 U27.12(MPPC)
NetR108_1: R108.1 R113.2
NetR111_2: R111.2 U27.7(PGOOD)
NetR112_2: R112.2 U27.10(VC)
NetR113_1: R113.1 R119.1 U27.9(FB)
NetR117_2: R117.2 U27.14(RT)
NetR120_2: R120.2 R122.2 U33.3(D) U35.6(SENSE)
NetR121_2: R121.2 R123.2 U34.3(D) U36.6(SENSE)

Not connected (* = marked no-connect by the designer): BAT 4*; D1 1*; D5 1*; D7 1*; J14 1(+3.3V)* 2(+3.3V)* 5(PWRL0)* 6(MISO1)* 7(PWRL1)* 8(MOSI1)* 9(PWRL2)* 10(CLK1)* 11(PWRL3)* 12(SS1)* 13(PWRL4)* 14(SYNC)* 15(PWRL5)* 17(PWRL6)* 18(DL2)* 19(PWRL7)* 20(NA)* 21(PWRL8)* 23(PWRL9)* 25(PWRL10) 27(NA)* 29(ASL1)* 30(CS9)* 31(ASL2)* 32(CS8)* 33(ASL3)* 34(CS7)* 35(DL1)* 36(CS6)* 38(CS5)* 39(RST)* 40(CS4)* 41(MISO2)* 42(CS3)* 43(MOSI2)* 44(CS2)* 45(CLK2)* 46(CS1)* 47(SS2)* 48(NA)* 51(+5V)* 52(+5V)*; J19 1(NA)* 2(NA)* 3(3.3V)* 4(3.3V)* 5(PSEL1)* 6(3.3V)* 7(PSEL2)* 9(PSEL3)* 10(PWRCTRL0)* 11(PAL1)* 12(PWRCTRL1)* 13(PAL)* 14(PWRCTRL2)* 15(PWR_RST)* 16(PWRCTRL3)* 17(MCAL1)* 18(PWRCTRL4)* 19(MCAL2)* 20(PWRCTRL5)* 21(MPWRCTRL1)* 22(PWRCTRL6)* 23(MPWRCTRL2)* 24(PWRCTRL7)* 25(SPSI1)* 26(PWRCTRL8)* 27(SPSI2)* 28(PWRCTRL9)* 29(MHB1)* 30(PWRCTRL10)* 31(MHB2)* 32(NA)* 33(3.3V)* 34(NA)* 36(NA)* 39(NA)* 40(NA)*; J_Antenna 1* 2* 3*; J_SAR 1*; R1 1 2; R20 1*; R21 2*; R22 2*; R40 2*; R47 2*; R53 2*; R54 1*; R73 2*; R75 2*; R80 2*; R81 2*; R85 2*; R86 2*; R102 2*; R109 2*; R110 2*; R114 2*; R115 2*; R124 2*; R125 2*; R126 2*; R127 2*; R128 2*; R129 2*; R130 2*; U8 3(EN)*; U11 8(PWRGD)*; U12 8(PWRGD)*; U17 3(EN)*; U20 8(PWRGD)*; U21 8(PWRGD)*; U22 8(PWRGD)*; U28 3(EN)*; U30 8(PWRGD)*; U31 8(PWRGD)*; U32 8(PWRGD)*; U35 8(PWRGD)*; U36 8(PWRGD)*; U37 12(A3)* 13(A0)*; U38 5(A5)*

## Notes on the sheet
- (near R2) Current Measurement
- (near U1) Kill Switch
- (near U2) RBF1
- (near U3) RBF2
- (near U4) Sepration Switch 2
- CORE_COM
- (near U7) Air Coil_3V3
- +16.86V
- 3.32V
- 3V3 (V&I) Measurement
- (near J3) 3V3
- (near U5) +16.66V
- (near J8) 3V3
- (near U14) CORE_OBC
- (near U15) ADCS_3V3
- (near U16) SAR_3V3
- +14.45V
- (near U18) +14.21V
- (near U24) Payload_5V
- (near U25) Power
- (near U26) Anti Timer
- 5.02V
- 5V (V&I) Measurement
- (near J12) 5V
- +4.82V
- +4.64V
- (near U34) ADM_5V
- Temp Measurement
- (near U33) GYRO (heaters)
- (near J17) PBF2